# Altium schematic sheet Block-Diagram.SchDoc: Overkill USB HUB
size A4; Revision: 1.0; SheetNumber: 1
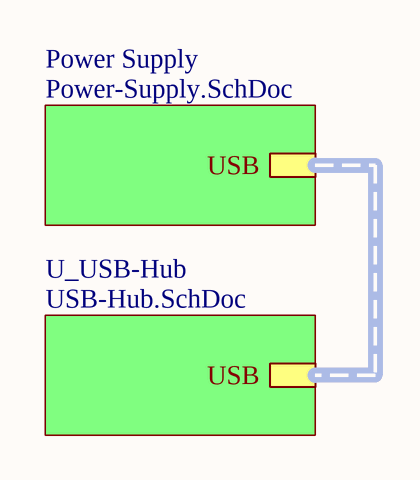
[diagram p0: Block-Diagram.SchDoc]

## Sub-sheets
Power Supply = Power-Supply.SchDoc: USB (harness USB-Input)
U_USB-Hub = USB-Hub.SchDoc: USB (harness USB-Input)

## Buses and harness runs
harness sheet Power Supply/USB = sheet U_USB-Hub/USB

## Notes on the sheet
- Projeto:
- Tamanho:
- Data:
- A4
- Eng. Felipe Navarro
- Hora:
- Revisão:
- Folha
- de
- Arquivo: